# EasyEDA Pro project led_fan_v1.0_led.eprj

# Board led_fan_v1.0_电_led
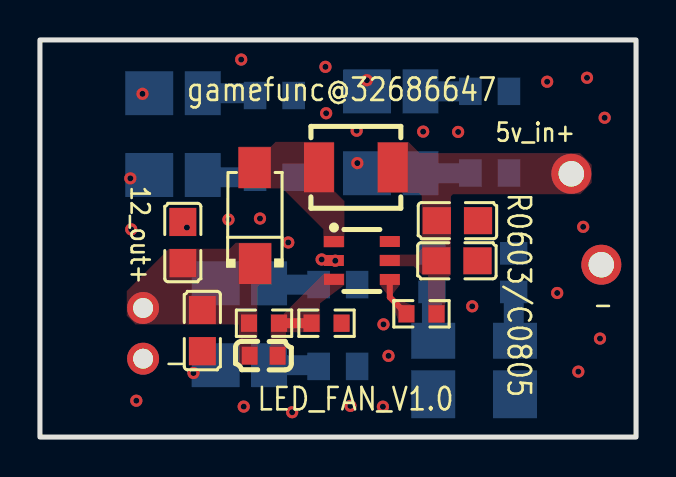
[diagram p0: board, top side]
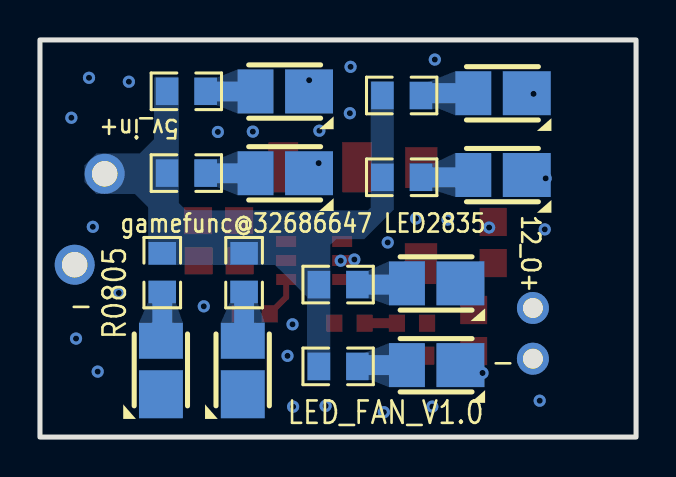
[diagram p1: board, bottom side, seen from below]

Outline 29.85 x 19.89 mm; copper layers: Top Layer, Bottom Layer. Coordinates in mm from the lower left corner of the outline.
Outline path: rectangle 0,19.89 29.85,0
Stack: Top Layer 0.035mm / Dielectric1 1.51mm FR4 er 4.5 / Bottom Layer 0.035mm

## Design rules (mm)
spacing safeClearance (default): track to track 0.152, other pairs 0.152 to 0.3
track width trackWidth (default): min 0.127, default 0.254, max 2.54
differential pair differentialPair (default): width min 0.127, default 0.254, max 2.54; gap min 0.152, default 0.152
via viaSize (default): diameter min 0.5, default 0.61, max 10; hole min 0.3, default 0.305, max 6

## Placement (name value [footprint] x y rotation side)
C1  -  [C0603]  11.2 4.08 0 top
C2  -  [C0805]  20.88 8.83 180 top
C3  -  [C0805]  7.15 9.74 270 top
C4  -  [C0805]  8.13 5.33 90 top
C5  -  [C0805]  20.9 10.84 180 top
D2  -  [SMA_L4.3-W2.6-LS5.0-RD]  10.76 11.09 90 top
L2  4.7uH  [IND-SMD_L4.5-W4.1_TMPA0402SP]  15.82 13.51 0 top
NOREF  -  [Pad_e42]  26.61 13.18 0 top
NOREF#2  -  [Pad_e12]  5.16 6.46 0 top
NOREF#3  -  [Pad_e29]  28.11 8.63 0 top
NOREF#4  -  [Pad_e11]  5.16 3.92 0 top
R11  -  [R0805]  14.92 3.54 180 bottom
R12  -  [R0805]  23.72 8.23 270 bottom
R13  -  [R0805]  22.52 17.32 180 bottom
R14  -  [R0805]  11.74 13.01 180 bottom
R15  -  [R0805]  22.52 13.22 180 bottom
R16  -  [R0805]  14.92 7.64 180 bottom
R17  100k  [R0603]  19.1 6.17 0 top
R18  -  [R0805]  19.63 8.23 270 bottom
R19  -  [R0805]  11.74 17.11 180 bottom
R20  R1  [R0603]  11.22 5.7 0 top
R21  R2  [R0603]  14.35 5.7 180 top
U9  +led-  [LED-SMD_L3.5-W2.8-FD_WHITE-1]  10.13 3.6 180 bottom
U10  +led-  [led-smd_l3.5-w2.8-fd_white-1]  19.69 3.48 270 bottom
U11  +led-  [LED-SMD_L3.5-W2.8-FD_WHITE-1]  23.79 3.48 270 bottom
U12  +led-  [LED-SMD_L3.5-W2.8-FD_WHITE-1]  6.81 17.22 180 bottom
U13  +led-  [LED-SMD_L3.5-W2.8-FD_WHITE-1]  6.81 13.12 180 bottom
U14  +led-  [LED-SMD_L3.5-W2.8-FD_WHITE-1]  10.13 7.7 180 bottom
U15  -  [SOT-23-6_L2.9-W1.6-P0.95-LS2.8-BR]  16.12 8.84 180 top
U16  +led-  [led-smd_l3.5-w2.8-fd_white-1]  17.71 13.21 180 bottom
U17  +led-  [led-smd_l3.5-w2.8-fd_white-1]  17.71 17.31 180 bottom

## Footprints (pads in the part's own frame, mm; a bottom-side part is the same pattern mirrored in y, then rotated)
C0603
  rect 0.8x0.9 smd: 1(-0.7,0) 2(0.7,0)
C0805
  rect 1.41x1.35 smd: 1(-1.03,0) 2(1.03,0)
IND-SMD_L4.5-W4.1_TMPA0402SP
  rect 1.5x2.5 smd: 1(-1.85,0) 2(1.85,0)
LED-SMD_L3.5-W2.8-FD_WHITE-1
  rect 1.8x2.2 smd: 1(-1.34,0)
  rect 2.4x2.2 smd: 2(1.34,0)
led-smd_l3.5-w2.8-fd_white-1
  rect 1.8x2.2 smd: 1(-1.34,0)
  rect 2.4x2.2 smd: 2(1.34,0)
Pad_e11
  round 1.6 hole 1: 1(0,0)
Pad_e12
  round 1.6 hole 1: 1(0,0)
Pad_e29
  round 2 hole 1.28: 1(0,0)
Pad_e42
  round 2 hole 1.28: 1(0,0)
R0603
  rect 0.806x0.864 smd: 1(-0.753,0) 2(0.753,0)
R0805
  rect 1.133x1.377 smd: 1(-0.966,0) 2(0.966,0)
SMA_L4.3-W2.6-LS5.0-RD
  rect 2.046x1.62 smd: 1(-2.404,-0.009) 2(2.404,0.009)
SOT-23-6_L2.9-W1.6-P0.95-LS2.8-BR
  rect 1x0.55 smd: 1(1.4,-0.95) 2(1.4,0) 3(1.4,0.95) 4(-1.4,0.95) 5(-1.4,0) 6(-1.4,-0.95)

## Nets
GND: C2.1 C3.1 C4.1 C5.1 NOREF#3.1 NOREF#4.1 R21.1 U9.2 U10.2 U11.2 U12.2 U13.2 U14.2 U15.2 U16.2 U17.2
V12_OUT: C1.1 C3.2 C4.2 D2.1 NOREF#2.1 R20.1
VIN_5V: C2.2 C5.2 L2.2 NOREF.1 R11.1 R12.1 R13.1 R14.1 R15.1 R16.1 R17.2 R18.1 R19.1 U15.5
EN: R17.1 U15.4
FB: C1.2 R20.2 R21.2 U15.3
LED+_0: R13.2 U17.1
LED+_1: R15.2 U16.1
LED+_2: R19.2 U12.1
LED+_3: R14.2 U13.1
LED+_4: R12.2 U11.1
LED+_5: R18.2 U10.1
LED+_6: R16.2 U14.1
LED+_7: R11.2 U9.1
SW_OUT: D2.2 L2.1 U15.1

Pads without a net: U15 6

## Via types
v1: diameter 0.61, hole 0.305, Top Layer to Bottom Layer, 33 vias

## Routing (per net, layer and track width the routed paths; a pad name or vN(x,y) marks a point on that pad's centre or on a via; arc(x,y) is an arc through that point)
GND:
  vias: v1(4.53,12.96) v1(4.57,10.4) v1(4.83,1.82) v1(5.13,17.19) v1(7.36,10.49) v1(7.69,3.21) v1(9.44,10.89) v1(10.08,18.9) v1(10.2,1.53) v1(11.02,10.94) v1(12.43,9.75) v1(12.63,1.24) v1(14.1,8.89) v1(14.3,18.54) v1(14.33,16.22) v1(14.79,8.83) v1(15.54,1.56) v1(15.86,15.34) v1(15.89,13.72) v1(16.37,17.87) v1(17.2,5.64) v1(17.17,1.52) v1(17.45,4.07) v1(19.19,15.3) v1(20.94,15.28) v1(21.64,6.55) v1(25.4,17.79) v1(25.9,7.22) v1(26.96,3.28) v1(27.2,10.53) v1(27.39,17.99) v1(28.04,4.93) v1(28.27,15.99)
EN: length 2.1
  Top Layer w0.3: R17.1 17.52,7 U15.4
FB: length 1.6
  Top Layer w0.5: R20.2 R21.2
LED+_0: length 2.5
  Bottom Layer w1: U17.1 21.54,17.31 R13.2
LED+_1: length 2.5
  Bottom Layer w1: R15.2 21.54,13.21 U16.1
LED+_2: length 2.7
  Bottom Layer w1: U12.1 10.66,17.22 R19.2
LED+_3: length 2.7
  Bottom Layer w1: U13.1 8.27,13.01 R14.2
LED+_4: length 2.5
  Bottom Layer w1: U11.1 23.72,4.89 R12.2
LED+_5: length 2.5
  Bottom Layer w1: R18.2 19.63,4.89 U10.1
LED+_6: length 2.5
  Bottom Layer w1: U14.1 11.53,7.64 R16.2
LED+_7: length 2.5
  Bottom Layer w1: R11.2 13.89,3.6 U9.1

## Copper pours and planes (outline as drawn; the poured copper is in the pictures)
GND on Top Layer: -2.46,21.36 36.68,21.36 39.81,18.23 31.83,10.25 31.83,-3.45 -7.28,-3.45 -7.31,-3.42 -2.46,1.44
GND on Bottom Layer: -5.65,22.34 30.84,22.34 31.92,21.26 31.92,-1.69 30.74,-2.87 -4.05,-2.87 -4.15,-2.97 -4.15,20.84
V12_OUT on Top Layer: 4.34,9.73 11.61,9.73 11.61,3.63 4.34,3.63
VIN_5V on Top Layer: 16.89,14.78 27.63,14.78 27.63,5.72 16.89,5.72
VIN_5V on Bottom Layer: 12.12,18.04 27.62,18.04 27.62,2.83 12.12,2.83
FB on Top Layer: 11.54,8.2 15.25,8.2 15.25,3.64 11.54,3.64
SW_OUT on Top Layer: 9.91,14.78 15.24,14.78 15.24,9.49 9.91,9.49

Small or netless copper shapes (teardrops, artwork), in the pictures only: 4 on Top Layer, 16 on Bottom Layer

## Text on the board
Bottom Silkscreen Layer: 12_O+ | 5v_in+ | gamefunc@32686647 LED2835 | LED_FAN_V1.0 | - | R0805
Top Silkscreen Layer: 12_out+ | - | 5v_in+ | gamefunc@32686647 | R0603/C0805 | LED_FAN_V1.0
